# EAGLE schematic byteWorkaholic (EAGLE 6.5.0)
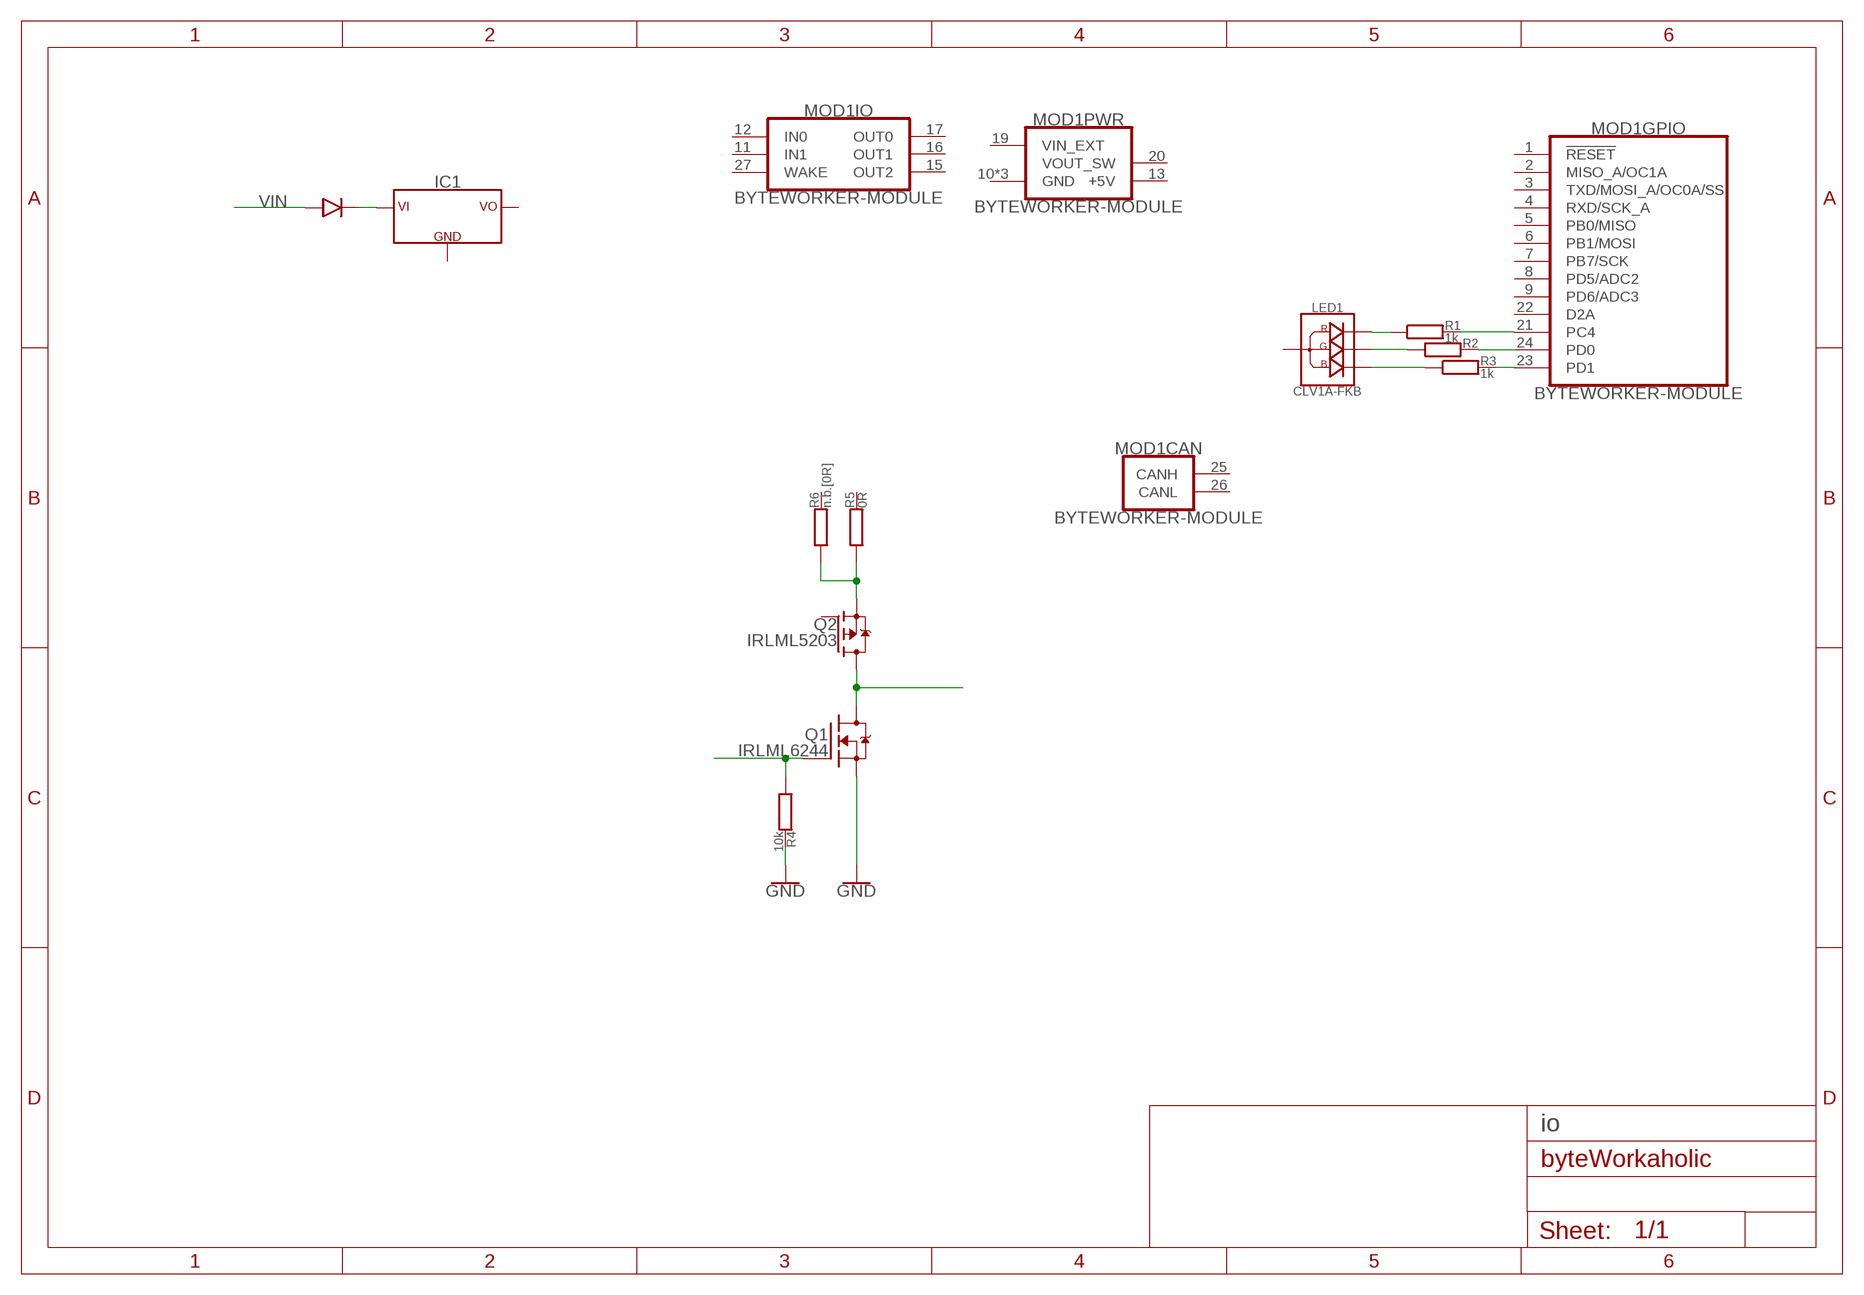
[diagram p0: schematic, sheet 1]

## Parts
D1  1N5819HW  [SOD123]
IC1  OKI-H  [OKI-H]
LED1  CLV1A-FKB  [CLV1A-FKB]
MOD1  BYTEWORKER-MODULE  [BYTEWORKER-MODULE]
Q1  IRLML6244  [SOT23]
Q2  IRLML5203  [SOT23]
R1  1k  R0603  [R0603]
R2  R0603  [R0603]
R3  1k  R0603  [R0603]
R4  10k  R0603  [R0603]
R5  0R  R0603  [R0603]
R6  n.b.[0R]  R0603  [R0603]

## Nets
GND: Q1.2(S) R4.2
N$1: LED1.R(R_C) R1.1
N$2: LED1.G(G_C) R2.1
N$3: LED1.B(B_C) R3.1
N$4: MOD1.23(GPIO:PD1) R3.2
N$5: MOD1.24(GPIO:PD0) R2.2
N$6: MOD1.21(GPIO:PC4) R1.2
N$7: D1.C IC1.1(VIN)
N$9: Q1.3(D) Q2.3(D)
N$10: Q1.1(G) R4.1
N$11: Q2.2(S) R5.1 R6.1
VIN: D1.A
Unconnected: IC1.3(VCC) LED1.A MOD1.1(GPIO:!RESET!) MOD1.2(GPIO:MISO_A/OC1A) MOD1.3(GPIO:TXD/MOSI_A/OC0A/SS) MOD1.4(GPIO:RXD/SCK_A) MOD1.5(GPIO:PB0/MISO) MOD1.6(GPIO:PB1/MOSI) MOD1.7(GPIO:PB7/SCK) MOD1.8(GPIO:PD5/ADC2) MOD1.9(GPIO:PD6/ADC3) MOD1.11(IO:IN1) MOD1.12(IO:IN0) MOD1.13(PWR:+5V) MOD1.15(IO:OUT2) MOD1.16(IO:OUT1) MOD1.17(IO:OUT0) MOD1.22(GPIO:D2A) MOD1.25(CAN:CANH) MOD1.26(CAN:CANL) MOD1.27(IO:WAKE) Q2.1(G) R5.2 R6.2

## Power pins joined to a net without a drawn wire
GND: IC1.2(GND) MOD1.10(PWR:GND) MOD1.18(PWR:GND) MOD1.28(PWR:GND)
VIN_EXT: MOD1.19(PWR:VIN_EXT)
VOUT_SW: MOD1.20(PWR:VOUT_SW)

## Library data of the parts
D1 = bytewerk-passive:1N5819HW: Si-Diode - Icont=1A; MF: DIODES INC.; MPN: 1N5819HW-7-F; OC_FARNELL: 1773475
IC1 = bytewerk-vreg:OKI; MF: Murata; MPN: OKI-78SR-5/1.5-W36H-C; OC_MOUSER: 580-OKI78SR51.5W36HC
LED1 = bytewerk-led:CLV1A-FKB: cheap RGB led with common Anode; MF: Cree; MPN: CLV1A-FKB; OC_MOUSER: 941-V1AFKBCHMKPEH7A3
MOD1 = bytewerk-module:BYTEWORKER-MODULE
Q1 = bytewerk-transistor:IRLML6244: n-channel FET Vds=20V Vgs=+-12V Icont=6A; MF: Internat. Rectifier; MPN: IRLML6244TRPbF; OC_FARNELL: 1864517RL
Q2 = bytewerk-transistor:IRLML5203: p-channel FET Icont=1.3A Vgs=+-20V Vds=30V; MF: International Rectifier; MPN: IRLML5203; OC_FARNELL: 9103511
R1-R6 = bytewerk-passive:R